# EAGLE design testovani_caroveho_senzoru (EAGLE 9.4.2)
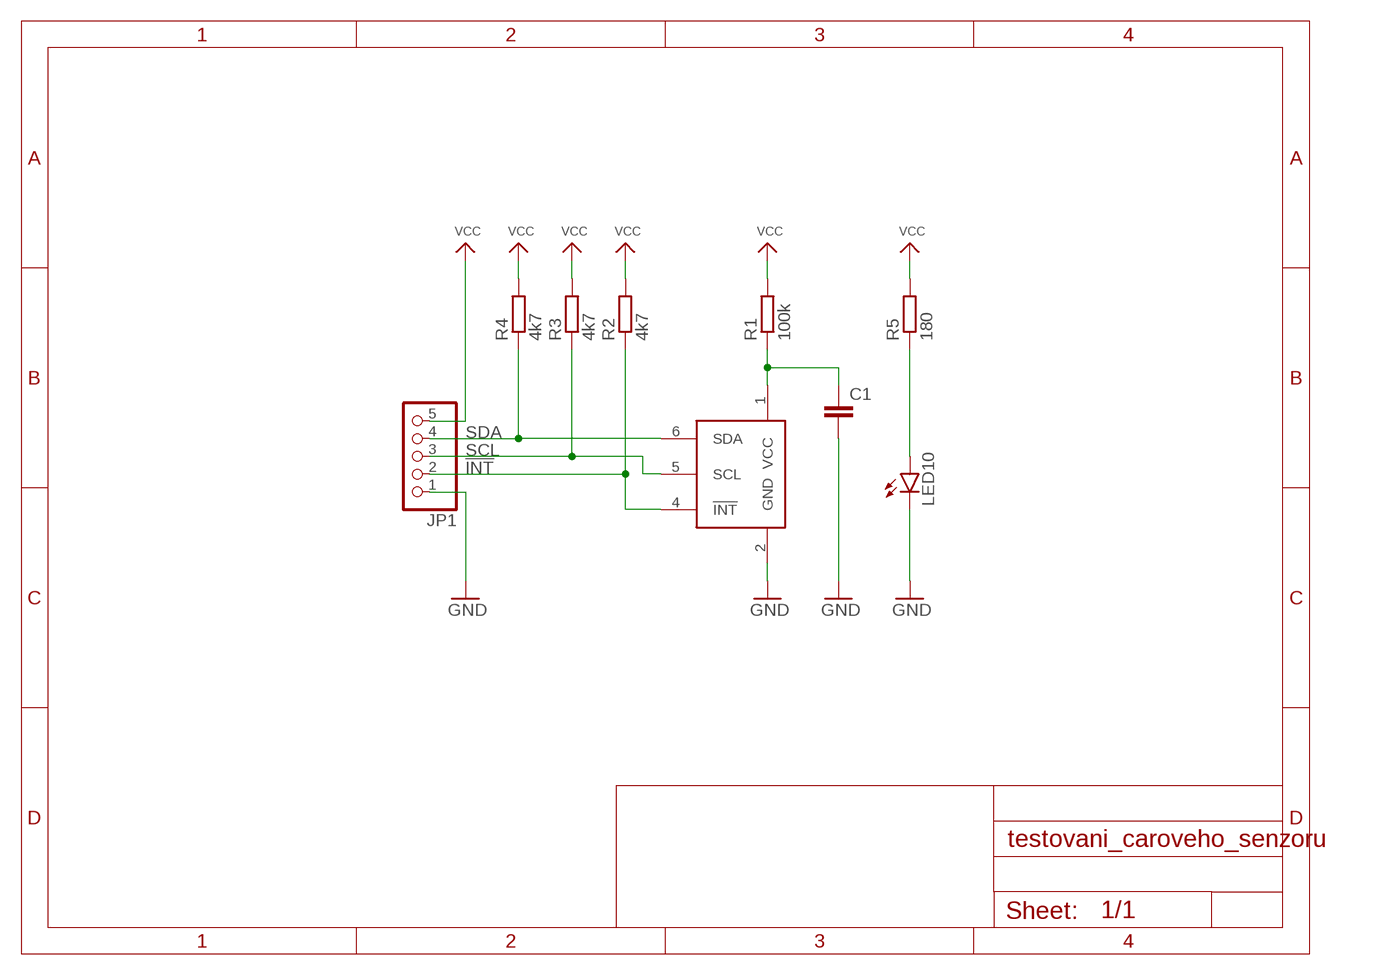
[diagram p0: schematic, sheet 1]

## Parts
C1  C-EUC0603  [C0603]
ISL10  ISL29035  [ISL29035]
JP1  PINHD-1X5  [1X05]
LED10  LEDCHIP-LED0603  [CHIP-LED0603]
R1  100k  R-EU_R0402  [R0402]
R2  4k7  R-EU_R0402  [R0402]
R3  4k7  R-EU_R0402  [R0402]
R4  4k7  R-EU_R0402  [R0402]
R5  180  R-EU_R0402  [R0402]

## Nets
!INT: ISL10.4(!INT) JP1.2 R2.1
GND: C1.2 ISL10.2(GND) JP1.1 LED10.C
N$4: C1.1 ISL10.1(VCC) R1.1
N$19: LED10.A R5.1
SCL: ISL10.5(SCL) JP1.3 R3.1
SDA: ISL10.6(SDA) JP1.4 R4.1
VCC: JP1.5 R1.2 R2.2 R3.2 R4.2 R5.2

## Library data of the parts
C1 = rcl:C-EU: CAPACITOR, European symbol; SPICEPREFIX: C
ISL10 = renesas:ISL29035
JP1 = pinhead:PINHD-1X5: PIN HEADER
LED10 = led:LED: LED OSRAM: - CHIPLED LG R971, LG N971, LY N971, LG Q971, LY Q971, LO R971, LY R971 LH N974, LH R974 LS Q976, LO Q976, LY Q976 LO Q996 - Hyper CHIPLED LW Q18S LB Q993, LB Q99A, LB R99A - SideLED LS A670, LO A670, LY A670, LG A670, LP A670 LB A673, LV A673, LT A673, LW A673 LH A674 LY A675 LS A676, LA A676, LO A676, LY A676, LW A676 LS A679, LY A679, LG A679 - Hyper Micro SIDELED® LS Y876, LA Y876, LO Y876, LY Y876 LT Y87S - SmartLED LW L88C, LW L88S LB L89C, LB L89S, LG L890 LS L89K, LO L89K, LY L89K LS L896, LA L896, LO L896, LY L896 - TOPLED LS T670, LO T670, LY T670, LG T670, LP T670 LSG T670, LSP T670, LSY T670, LOP T670, LYG T670 LG T671, LOG T671, LSG T671 LB T673, LV T673, LT T673, LW T673 LH T674 LS T676, LA T676, LO T676, LY T676, LB T676, LH T676, LSB T676, LW T676 LB T67C, LV T67C, LT T67C, LS T67K, LO T67K, LY T67K, LW E67C LS E67B, LA E67B, LO E67B, LY E67B, LB E67C, LV E67C, LT E67C LW T67C LS T679, LY T679, LG T679 LS T770, LO T770, LY T770, LG T770, LP T770 LB T773, LV T773, LT T773, LW T773 LH T774 LS E675, LA E675, LY E675, LS T675 LS T776, LA T776, LO T776, LY T776, LB T776 LHGB T686 LT T68C, LB T68C - Hyper Mini TOPLED® LB M676 - Mini TOPLED Santana® LG M470 LS M47K, LO M47K, LY M47K Source: http://www.osram.convergy.de LUXEON: - LUMILED® LXK2-PW12-R00, LXK2-PW12-S00, LXK2-PW14-U00, LXK2-PW14-V00 LXK2-PM12-R00, LXK2-PM12-S00, LXK2-PM14-U00 LXK2-PE12-Q00, LXK2-PE12-R00, LXK2-PE12-S00, LXK2-PE14-T00, LXK2-PE14-U00 LXK2-PB12-K00, LXK2-PB12-L00, LXK2-PB12-M00, LXK2-PB14-N00, LXK2-PB14-P00, LXK2-PB14-Q00 LXK2-PR12-L00, LXK2-PR12-M00, LXK2-PR14-Q00, LXK2-PR14-R00 LXK2-PD12-Q00, LXK2-PD12-R00, LXK2-PD12-S00 LXK2-PH12-R00, LXK2-PH12-S00 LXK2-PL12-P00, LXK2-PL12-Q00, LXK2-PL12-R00 Source: www.luxeon.com KINGBRIGHT: KA-3528ASYC Source: www.kingbright.com
R1-R5 = rcl:R-EU_: RESISTOR, European symbol; SPICEPREFIX: R

## Net classes
0 default: width 0.2 mm, drill 0.35 mm, clearance 0.2 mm

## Board
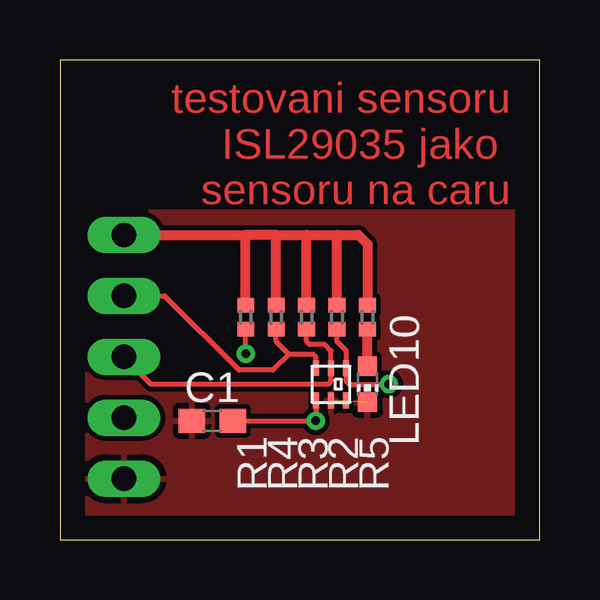
[diagram p1: board, top side]
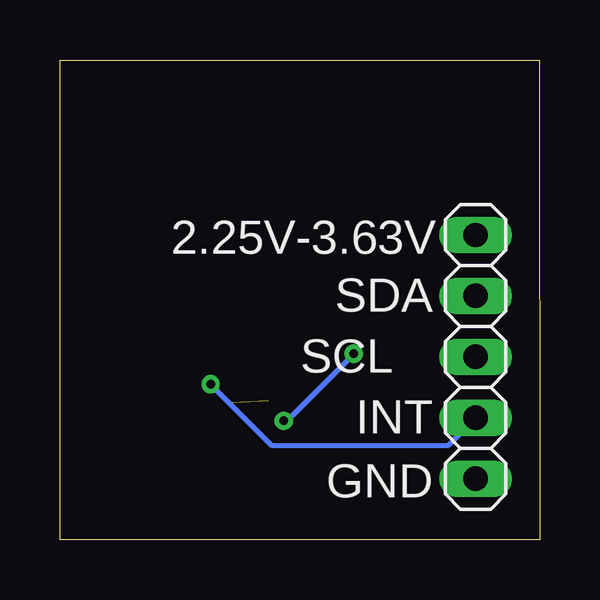
[diagram p2: board, bottom side, seen from below]

Size 20 x 20 mm. Coordinates in mm from the lower left corner, seen from the top.
Outline: 0,0 20,0 20,20 0.01,20 0,0
Copper layers (1*16): Top 0.035mm / dielectric 1.5mm / Bottom 0.035mm
Design rules "default": minimum track width 6mil, minimum drill 0.35mm, track to track 6mil, track to pad 6mil, pad to pad 6mil, via to via 6mil, smd to smd 6mil, copper to edge 40mil, drill to drill 6mil, minimum pad ring 10mil, minimum via ring 8mil, stop-mask expansion 4mil, vias tented up to drill 0mil, thermal gap 10mil
tRestrict: 1 lines

### Footprints (pad centres in the part's own frame; a part is rotated, then mirrored left to right if it is on the bottom)
C0603 = smd 1.1 x 1: 1 -0.85,0; 2 0.85,0
ISL29035 = smd 0.65 x 0.25: 1 -0.675,0.625; 2 -0.675,0; 3 -0.675,-0.625; 4 0.675,-0.625; 5 0.675,0; 6 0.675,0.625
1X05 = drill 1.016 long: 1 -5.08,0; 2 -2.54,0; 3 0,0; 4 2.54,0; 5 5.08,0
CHIP-LED0603 = smd 0.8 x 0.8: A 0,-0.75; C 0,0.75
R0402 = smd 0.6 x 0.7: 1 -0.5,0; 2 0.5,0

### Placement (x,y rotation side)
C1  6.35,4.95 180 top
ISL10  11.3,6.48 90 top
JP1  2.67,7.62 90 bottom
LED10  12.83,6.48 180 top
R1  7.75,9.27 90 top
R2  11.56,9.27 90 top
R3  10.29,9.27 90 top
R4  9.02,9.27 90 top
R5  12.83,9.27 90 top

### Tracks (layer width: path | path; a pad name or v marks a point on that pad's centre or on a via)
!INT  (via drill 0.35)
  Top 0.2: R2.1 11.56,8.26 11.93,7.88 ISL10.4 11.93,6.61 12.06,6.48 v13.72,6.48
  Bottom 0.2: v13.72,6.48 11.18,3.94 3.81,3.94 JP1.2
GND  (1 unrouted)
  pour Top: -2.54,22.86 -2.54,-2.54 22.86,-2.54 22.86,22.86
N$4  (via drill 0.35)
  Top 0.2: v7.75,7.75 R1.1 | ISL10.1 v10.68,4.95 v10.67,4.95 C1.1
  Bottom 0.2: v10.67,4.95 10.54,4.95 v7.75,7.75
N$19
  Top 0.406: LED10.A R5.1
SCL
  Top 0.2: R3.1 10.29,8.26 10.41,8.13 11.05,8.13 11.3,7.87 ISL10.5 11.3,6.6 11.18,6.48 3.81,6.48 JP1.3
SDA
  Top 0.2: ISL10.6 10.67,7.16 10.67,7.62 10.56,7.73 9.54,7.73 | 9.54,7.73 9.02,8.26 R4.1 | 9.54,7.73 8.88,7.07 7.47,7.07 4.38,10.16 JP1.4
VCC
  Top 0.406: JP1.5 7.75,12.7 | 9.02,12.7 10.29,12.7 | 10.29,12.7 11.56,12.7 | 11.56,12.7 12.45,12.7 12.83,12.32 R5.2 | R2.2 11.56,12.7 | R3.2 10.29,12.7 | R4.2 9.02,12.7 | 9.02,12.7 7.75,12.7 | R1.2 7.75,12.7

### Text on the board
Top: testovani sensoru / ISL29035 jako / sensoru na caru
bNames: 2.25V-3.63V | SDA | SCL | INT | GND